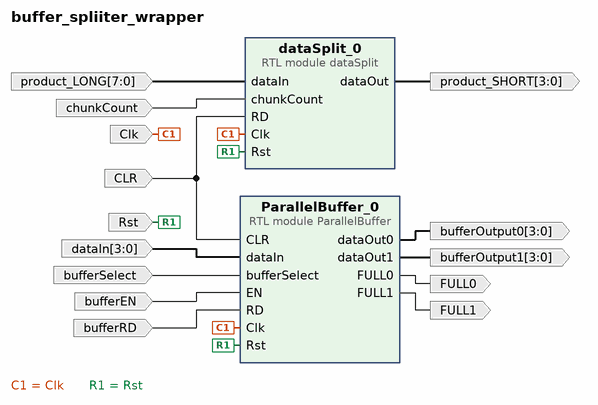
[diagram p0: block diagram of the top level]
# Vivado block design buffer_spliiter_wrapper, xc7z020clg400-1, Vivado 2019.2
create_bd_design buffer_spliiter_wrapper

create_bd_port -dir I -type clk Clk
create_bd_port -dir I -from 3 -to 0 dataIn
create_bd_port -dir I bufferSelect
create_bd_port -dir I bufferEN
create_bd_port -dir I bufferRD
create_bd_port -dir I -type rst Rst
create_bd_port -dir I CLR
create_bd_port -dir I -from 7 -to 0 product_LONG
create_bd_port -dir I chunkCount
create_bd_port -dir O -from 3 -to 0 bufferOutput1
create_bd_port -dir O -from 3 -to 0 bufferOutput0
create_bd_port -dir O FULL0
create_bd_port -dir O FULL1
create_bd_port -dir O -from 3 -to 0 product_SHORT

create_bd_cell -type module -reference dataSplit dataSplit_0
create_bd_cell -type module -reference ParallelBuffer ParallelBuffer_0

# ---- connections ----

connect_bd_net -net Clk_0_1 [get_bd_ports Clk] [get_bd_pins dataSplit_0/Clk] [get_bd_pins ParallelBuffer_0/Clk]
connect_bd_net -net dataIn_0_1 [get_bd_ports dataIn] [get_bd_pins ParallelBuffer_0/dataIn]
connect_bd_net -net bufferSelect_0_1 [get_bd_ports bufferSelect] [get_bd_pins ParallelBuffer_0/bufferSelect]
connect_bd_net -net EN_0_1 [get_bd_ports bufferEN] [get_bd_pins ParallelBuffer_0/EN]
connect_bd_net -net RD_0_1 [get_bd_ports bufferRD] [get_bd_pins ParallelBuffer_0/RD]
connect_bd_net -net Rst_0_1 [get_bd_ports Rst] [get_bd_pins dataSplit_0/Rst] [get_bd_pins ParallelBuffer_0/Rst]
connect_bd_net -net CLR_0_1 [get_bd_ports CLR] [get_bd_pins dataSplit_0/RD] [get_bd_pins ParallelBuffer_0/CLR]
connect_bd_net -net dataIn_0_2 [get_bd_ports product_LONG] [get_bd_pins dataSplit_0/dataIn]
connect_bd_net -net chunkCount_0_1 [get_bd_ports chunkCount] [get_bd_pins dataSplit_0/chunkCount]
connect_bd_net [get_bd_pins ParallelBuffer_0/dataOut1] [get_bd_ports bufferOutput1]
connect_bd_net [get_bd_pins ParallelBuffer_0/dataOut0] [get_bd_ports bufferOutput0]
connect_bd_net [get_bd_pins ParallelBuffer_0/FULL0] [get_bd_ports FULL0]
connect_bd_net [get_bd_pins ParallelBuffer_0/FULL1] [get_bd_ports FULL1]
connect_bd_net [get_bd_pins dataSplit_0/dataOut] [get_bd_ports product_SHORT]

validate_bd_design
save_bd_design
